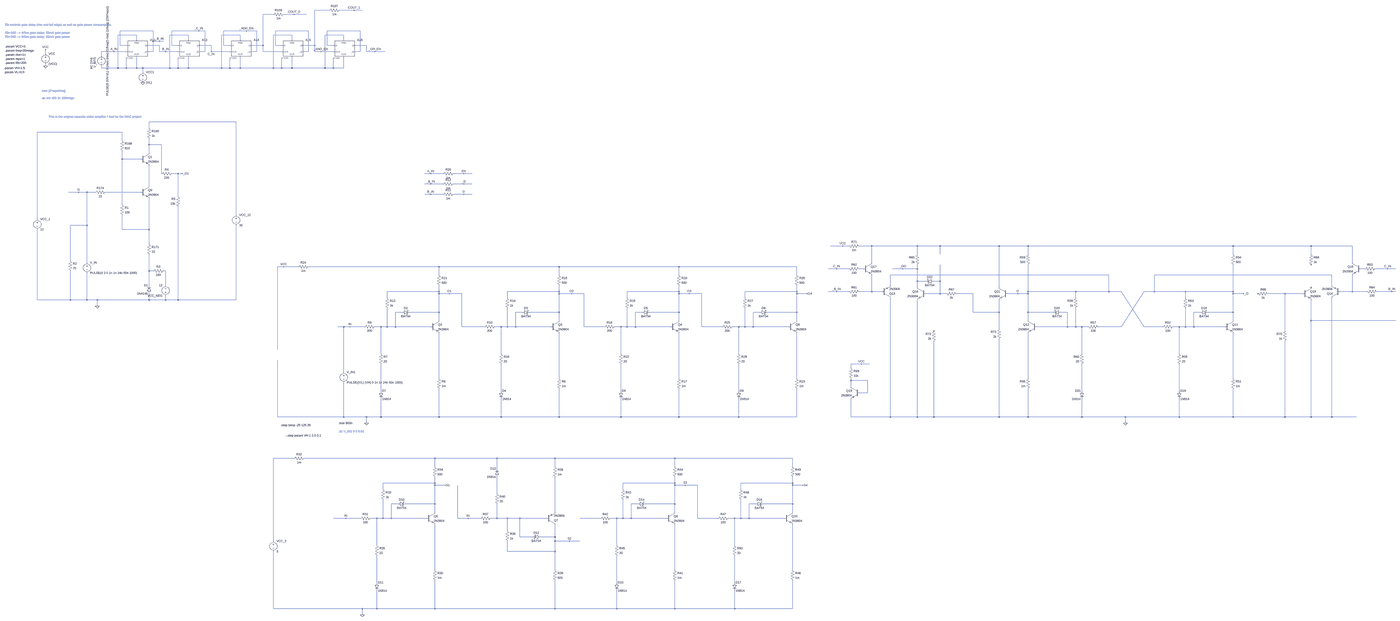
[diagram p0: schematic register_bjt.asc, whole sheet]
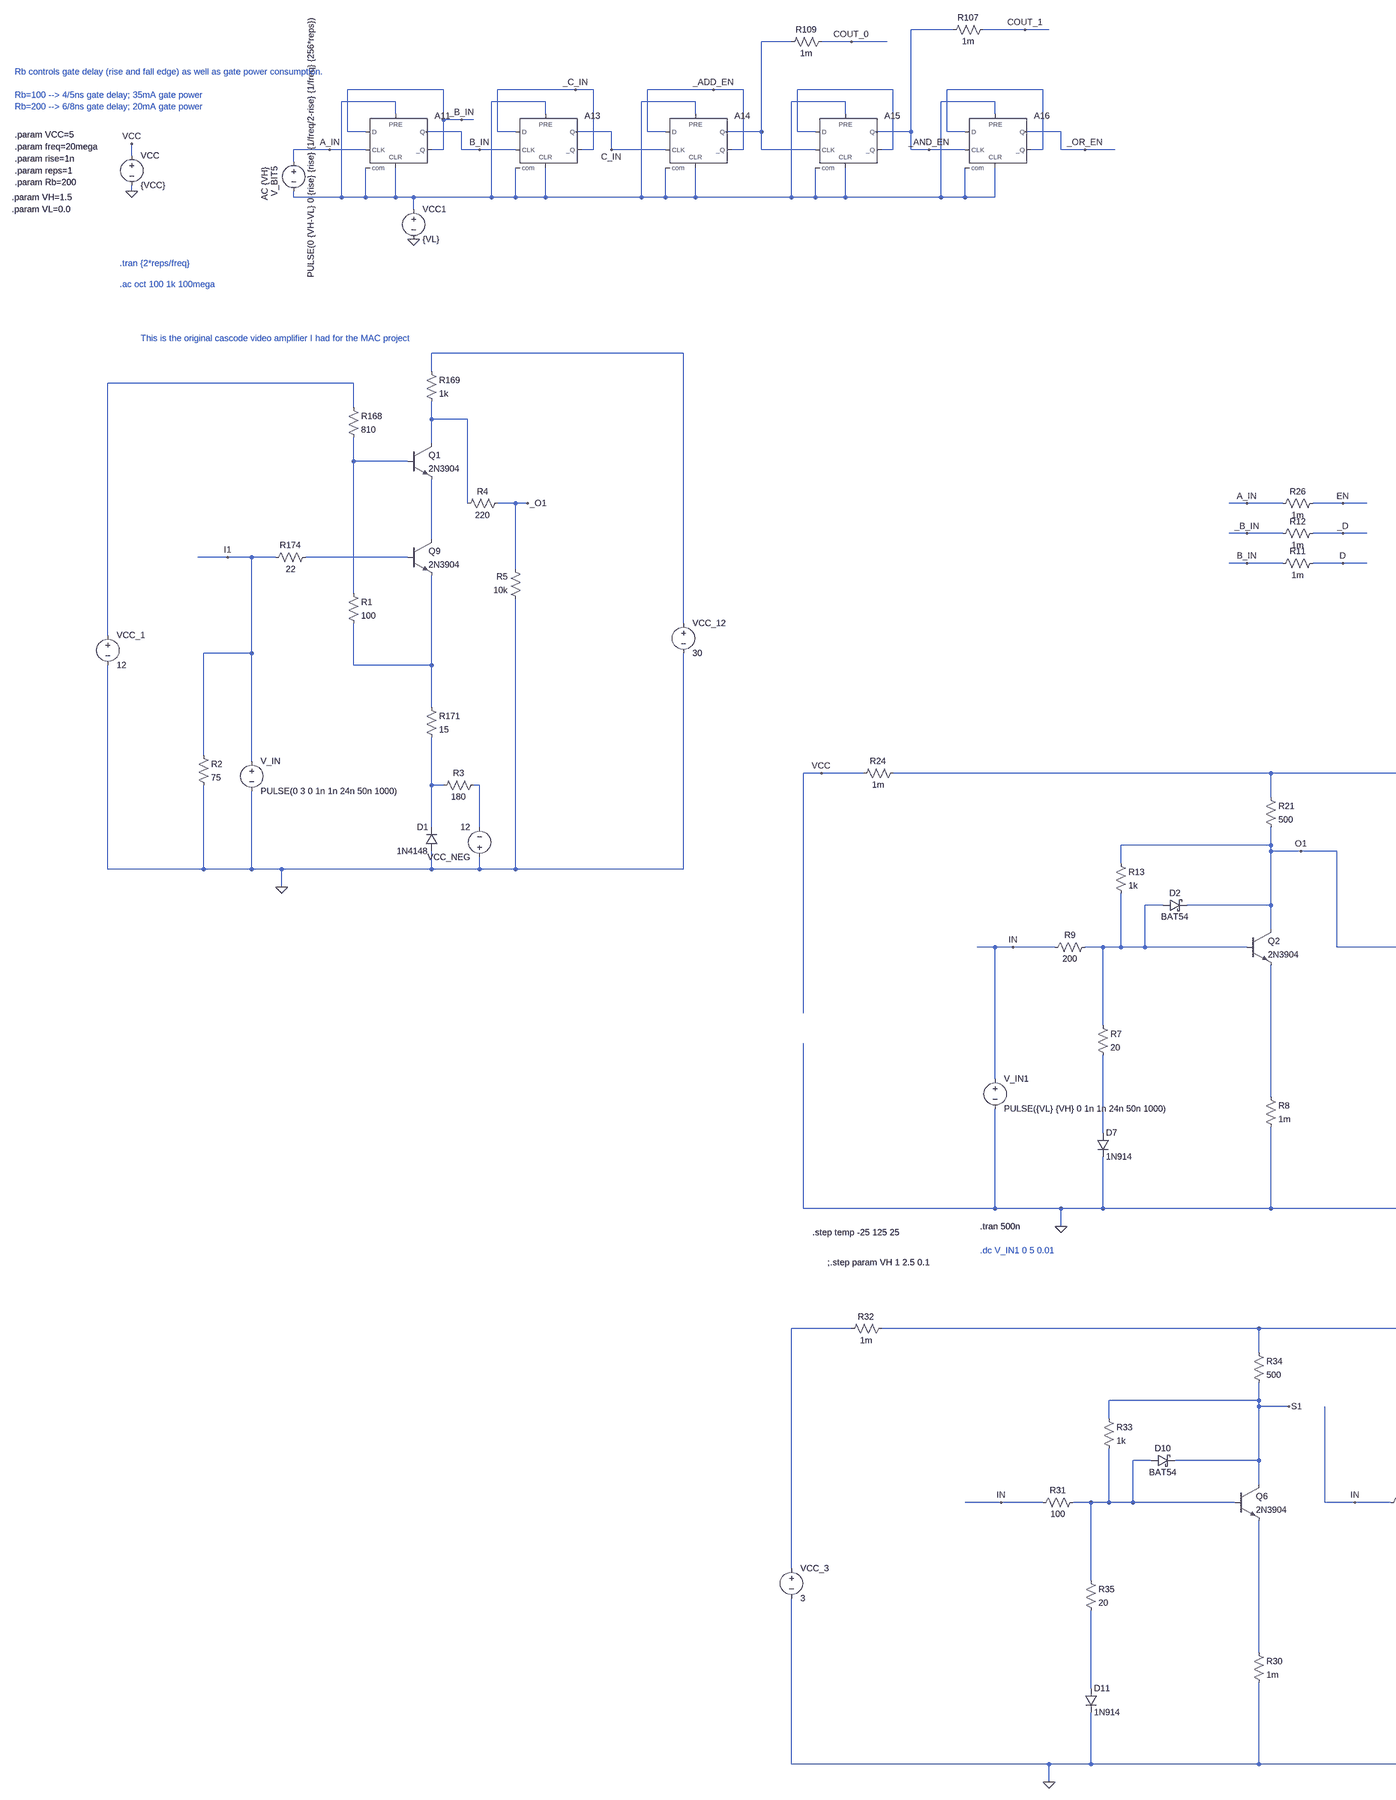
[diagram p1: schematic register_bjt.asc, part, row 1 of 1, column 1 of 3]
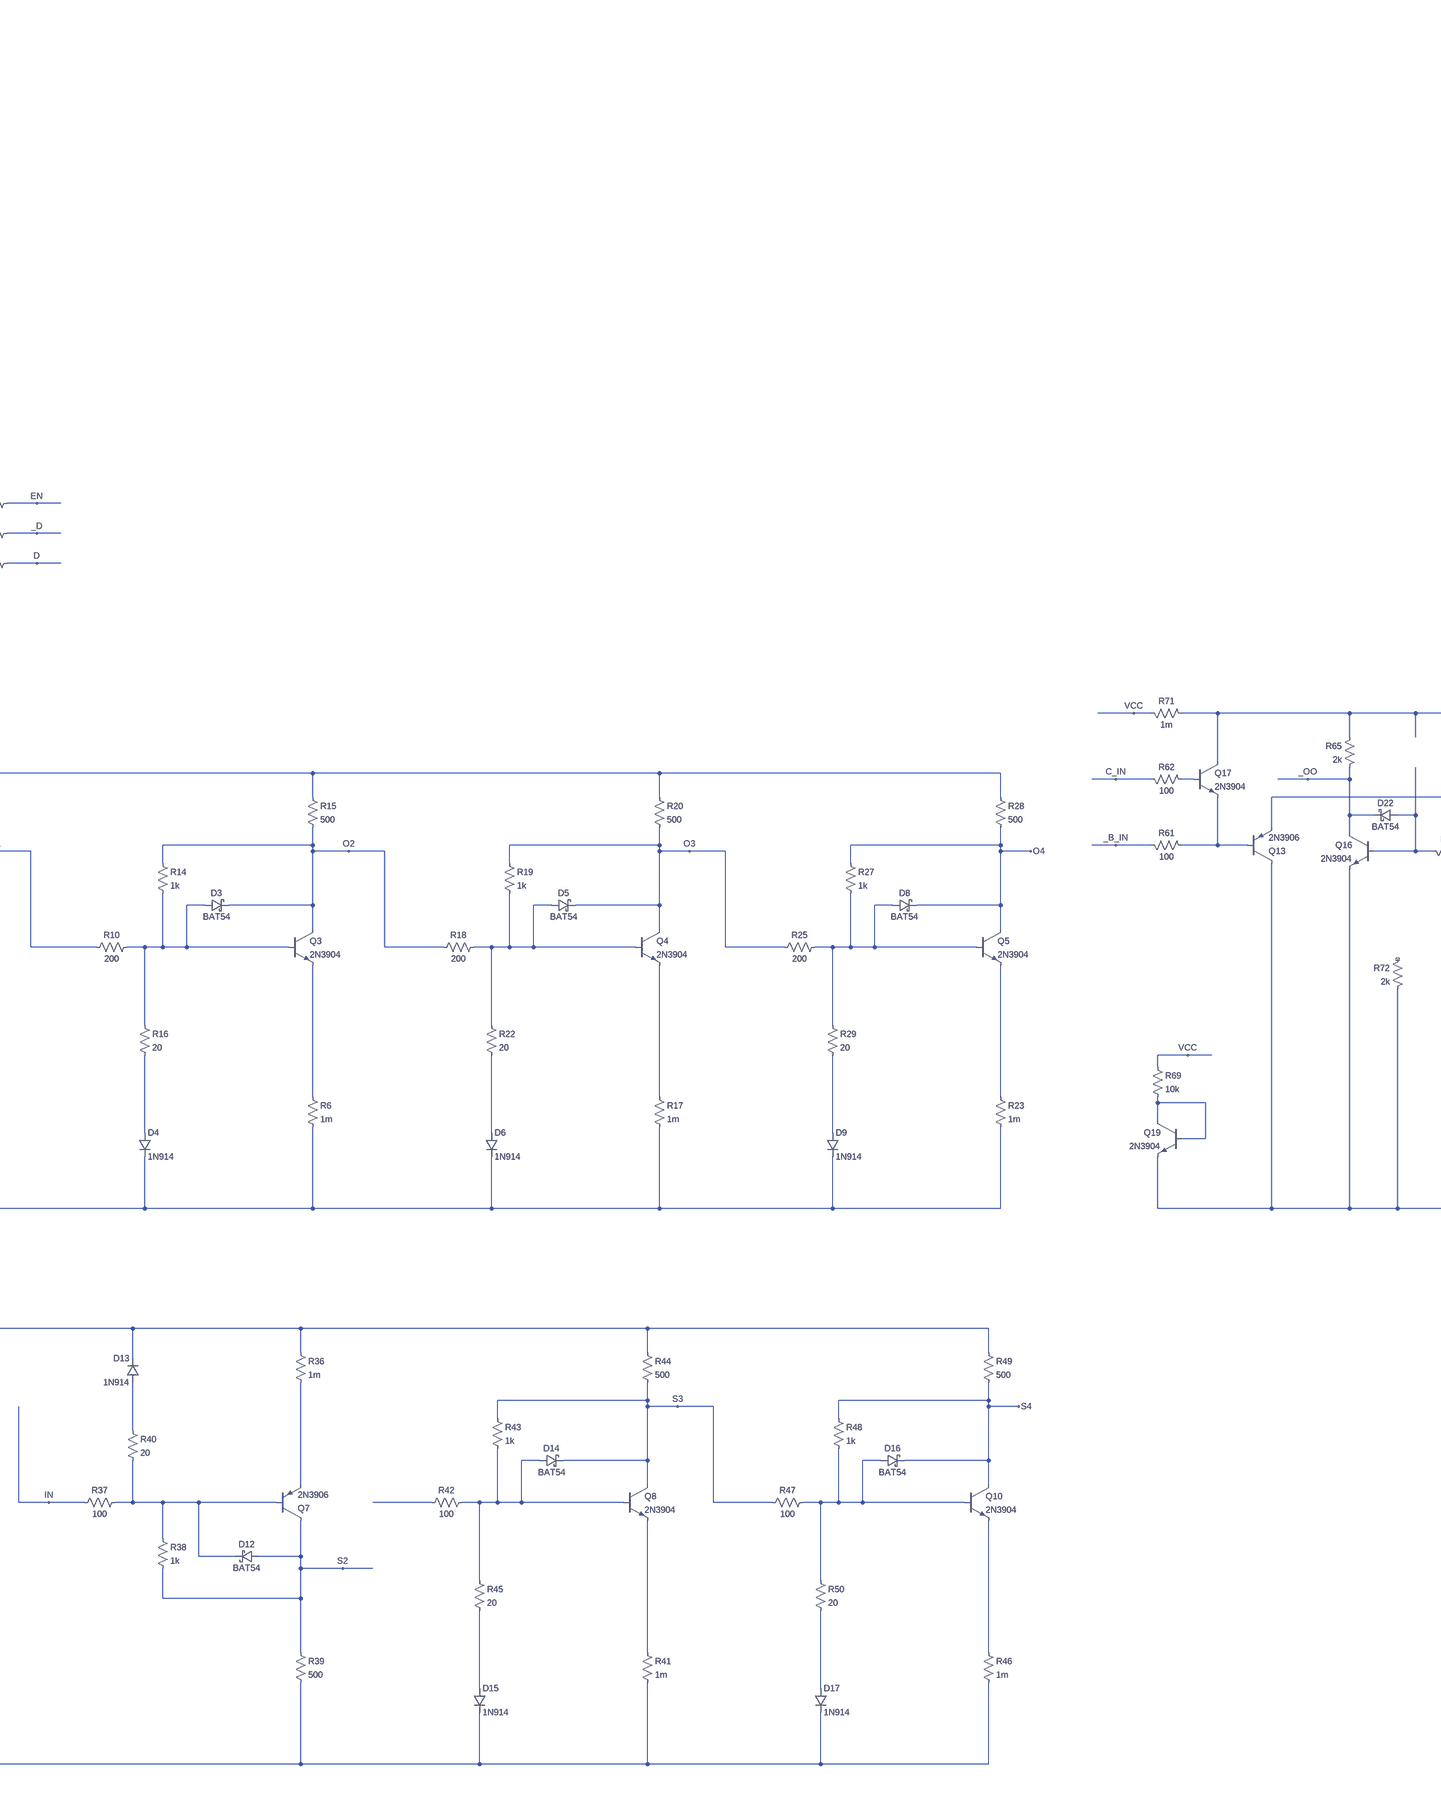
[diagram p2: schematic register_bjt.asc, part, row 1 of 1, column 2 of 3]
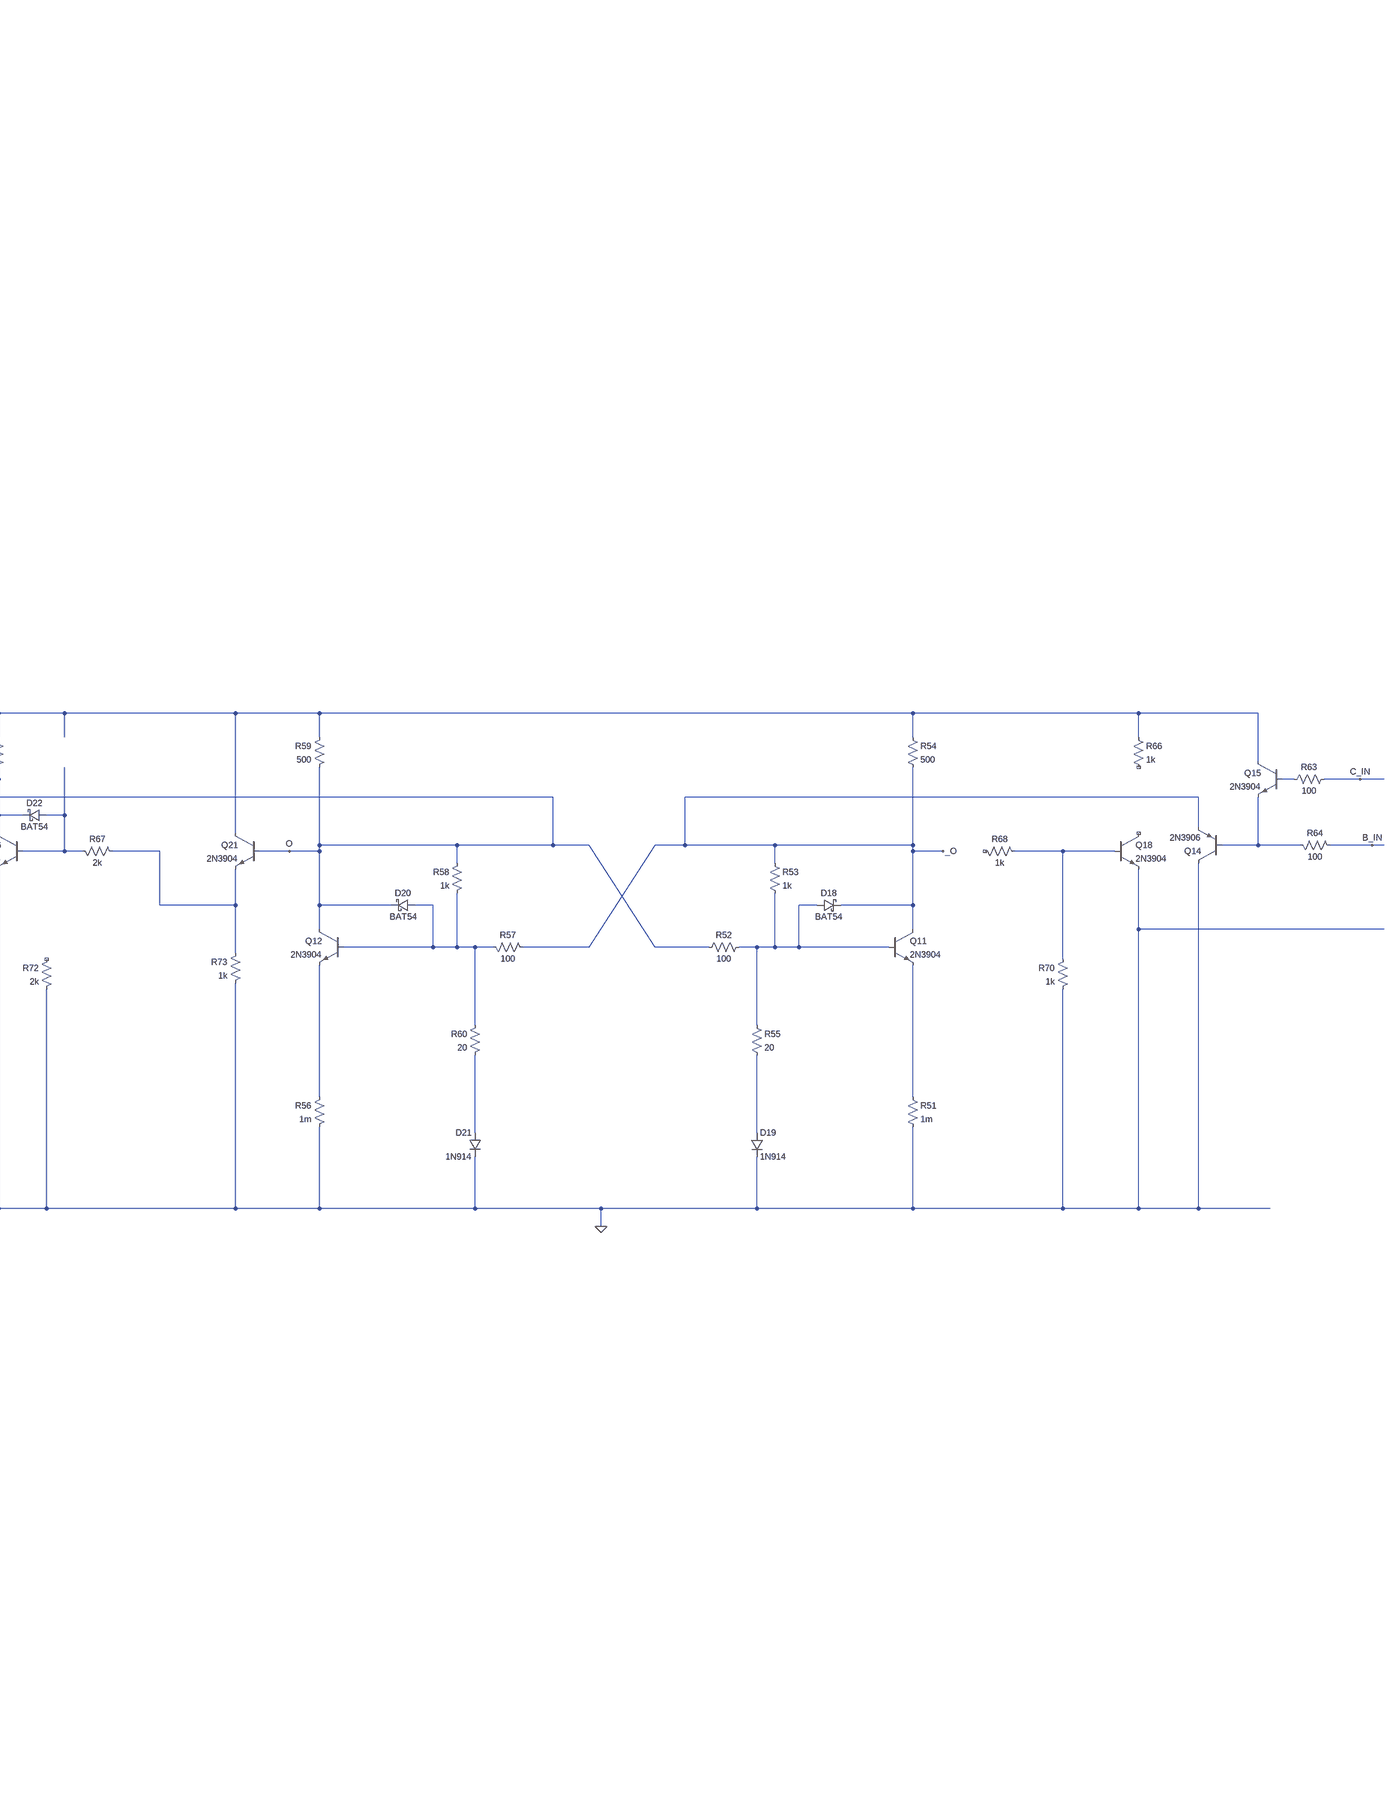
[diagram p3: schematic register_bjt.asc, part, row 1 of 1, column 3 of 3]
register_bjt.asc, the LTspice schematic file:
Version 4
SHEET 1 20052 9880
WIRE 1392 1344 1280 1344
WIRE 1584 1344 1472 1344
WIRE 1648 1344 1584 1344
WIRE 960 1376 880 1376
WIRE 1120 1376 1040 1376
WIRE 1216 1376 1120 1376
WIRE 32 1504 -224 1504
WIRE 384 1504 176 1504
WIRE 432 1504 384 1504
WIRE 752 1504 576 1504
WIRE 832 1504 752 1504
WIRE 1232 1504 976 1504
WIRE 1632 1504 1376 1504
WIRE -96 1536 -240 1536
WIRE 304 1536 160 1536
WIRE 704 1536 560 1536
WIRE 1104 1536 960 1536
WIRE 1504 1536 1360 1536
WIRE -96 1568 -96 1536
WIRE 304 1568 304 1536
WIRE 704 1568 704 1536
WIRE 1104 1568 1104 1536
WIRE 1504 1568 1504 1536
WIRE 32 1584 32 1504
WIRE 80 1584 32 1584
WIRE 112 1584 80 1584
WIRE -224 1616 -224 1504
WIRE -176 1616 -224 1616
WIRE 80 1616 -16 1616
WIRE 176 1616 176 1504
WIRE 224 1616 176 1616
WIRE 480 1616 384 1616
WIRE 576 1616 576 1504
WIRE 624 1616 576 1616
WIRE 880 1616 880 1376
WIRE 880 1616 784 1616
WIRE 976 1616 976 1504
WIRE 1024 1616 976 1616
WIRE 1280 1616 1280 1344
WIRE 1280 1616 1184 1616
WIRE 1376 1616 1376 1504
WIRE 1424 1616 1376 1616
WIRE 1680 1616 1584 1616
WIRE -272 1664 -368 1664
WIRE -176 1664 -272 1664
WIRE 32 1664 32 1584
WIRE 32 1664 0 1664
WIRE 80 1664 80 1616
WIRE 128 1664 80 1664
WIRE 224 1664 128 1664
WIRE 432 1664 432 1504
WIRE 432 1664 400 1664
WIRE 480 1664 480 1616
WIRE 624 1664 480 1664
WIRE 832 1664 832 1504
WIRE 832 1664 800 1664
WIRE 880 1664 880 1616
WIRE 1024 1664 880 1664
WIRE 1232 1664 1232 1504
WIRE 1232 1664 1200 1664
WIRE 1280 1664 1280 1616
WIRE 1328 1664 1280 1664
WIRE 1424 1664 1328 1664
WIRE 1632 1664 1632 1504
WIRE 1632 1664 1600 1664
WIRE 1680 1664 1680 1616
WIRE 1744 1664 1680 1664
WIRE 1824 1664 1744 1664
WIRE -800 1680 -800 1648
WIRE -368 1696 -368 1664
WIRE -800 1776 -800 1760
WIRE -368 1792 -368 1776
WIRE -240 1792 -240 1536
WIRE -240 1792 -368 1792
WIRE -176 1792 -176 1712
WIRE -176 1792 -240 1792
WIRE -96 1792 -96 1712
WIRE -96 1792 -176 1792
WIRE -48 1792 -96 1792
WIRE 160 1792 160 1536
WIRE 160 1792 -48 1792
WIRE 224 1792 224 1712
WIRE 224 1792 160 1792
WIRE 304 1792 304 1712
WIRE 304 1792 224 1792
WIRE 560 1792 560 1536
WIRE 560 1792 304 1792
WIRE 624 1792 624 1712
WIRE 624 1792 560 1792
WIRE 704 1792 704 1712
WIRE 704 1792 624 1792
WIRE 960 1792 960 1536
WIRE 960 1792 704 1792
WIRE 1024 1792 1024 1712
WIRE 1024 1792 960 1792
WIRE 1104 1792 1104 1712
WIRE 1104 1792 1024 1792
WIRE 1360 1792 1360 1536
WIRE 1360 1792 1104 1792
WIRE 1424 1792 1424 1712
WIRE 1424 1792 1360 1792
WIRE 1504 1792 1504 1712
WIRE 1504 1792 1424 1792
WIRE -48 1824 -48 1792
WIRE 672 2208 0 2208
WIRE 0 2256 0 2208
WIRE -208 2288 -864 2288
WIRE -208 2352 -208 2288
WIRE 0 2384 0 2336
WIRE 96 2384 0 2384
WIRE 0 2448 0 2384
WIRE -208 2496 -208 2432
WIRE -64 2496 -208 2496
WIRE 96 2608 96 2384
WIRE 224 2608 176 2608
WIRE 256 2608 224 2608
WIRE 2176 2608 2128 2608
WIRE 2272 2608 2176 2608
WIRE 2432 2608 2352 2608
WIRE 2496 2608 2432 2608
WIRE 2176 2688 2128 2688
WIRE 2272 2688 2176 2688
WIRE 2432 2688 2352 2688
WIRE 2496 2688 2432 2688
WIRE 0 2704 0 2544
WIRE -544 2752 -624 2752
WIRE -480 2752 -544 2752
WIRE -416 2752 -480 2752
WIRE -64 2752 -336 2752
WIRE 2176 2768 2128 2768
WIRE 2272 2768 2176 2768
WIRE 2432 2768 2352 2768
WIRE 2496 2768 2432 2768
WIRE 224 2784 224 2608
WIRE -208 2848 -208 2496
WIRE 672 2928 672 2208
WIRE -864 2960 -864 2288
WIRE -480 3008 -480 2752
WIRE -480 3008 -608 3008
WIRE -208 3040 -208 2928
WIRE 0 3040 0 2800
WIRE 0 3040 -208 3040
WIRE 0 3152 0 3040
WIRE 6192 3168 6096 3168
WIRE 6240 3168 6192 3168
WIRE 6416 3168 6320 3168
WIRE 6768 3168 6416 3168
WIRE 6944 3168 6768 3168
WIRE 7984 3168 6944 3168
WIRE 8208 3168 7984 3168
WIRE 9856 3168 8208 3168
WIRE 10480 3168 9856 3168
WIRE 10800 3168 10480 3168
WIRE 6768 3232 6768 3168
WIRE 6944 3232 6944 3168
WIRE 8208 3232 8208 3168
WIRE 9856 3232 9856 3168
WIRE 10480 3232 10480 3168
WIRE -608 3280 -608 3008
WIRE -480 3296 -480 3008
WIRE 6416 3296 6416 3168
WIRE 10800 3296 10800 3168
WIRE 1040 3328 992 3328
WIRE 1152 3328 1040 3328
WIRE 2240 3328 1232 3328
WIRE 3168 3328 2240 3328
WIRE 4112 3328 3168 3328
WIRE 5040 3328 4112 3328
WIRE 6144 3344 6080 3344
WIRE 6240 3344 6144 3344
WIRE 6352 3344 6320 3344
WIRE 6656 3344 6576 3344
WIRE 6768 3344 6768 3312
WIRE 6768 3344 6656 3344
WIRE 10896 3344 10864 3344
WIRE 11072 3344 10976 3344
WIRE 11136 3344 11072 3344
WIRE 0 3360 0 3232
WIRE 32 3360 0 3360
WIRE 128 3360 112 3360
WIRE 2240 3392 2240 3328
WIRE 3168 3392 3168 3328
WIRE 4112 3392 4112 3328
WIRE 5040 3392 5040 3328
WIRE 8864 3392 6560 3392
WIRE 10640 3392 9216 3392
WIRE 6768 3440 6768 3344
WIRE 6832 3440 6768 3440
WIRE 6944 3440 6944 3312
WIRE 6944 3440 6896 3440
WIRE 0 3472 0 3360
WIRE 128 3472 128 3360
WIRE 6560 3472 6560 3392
WIRE 10640 3472 10640 3392
WIRE 6768 3488 6768 3440
WIRE 7984 3488 7984 3168
WIRE 2240 3520 2240 3472
WIRE 2240 3520 1840 3520
WIRE 3168 3520 3168 3472
WIRE 3168 3520 2768 3520
WIRE 4112 3520 4112 3472
WIRE 4112 3520 3712 3520
WIRE 5040 3520 5040 3472
WIRE 5040 3520 4640 3520
WIRE 6144 3520 6080 3520
WIRE 6240 3520 6144 3520
WIRE 6416 3520 6416 3392
WIRE 6416 3520 6320 3520
WIRE 6496 3520 6416 3520
WIRE 8208 3520 8208 3312
WIRE 8608 3520 8208 3520
WIRE 8864 3520 8864 3392
WIRE 8864 3520 8608 3520
WIRE 8960 3520 8864 3520
WIRE 9216 3520 9216 3392
WIRE 9216 3520 9136 3520
WIRE 9456 3520 9216 3520
WIRE 9856 3520 9856 3312
WIRE 9856 3520 9456 3520
WIRE 10800 3520 10800 3392
WIRE 10800 3520 10704 3520
WIRE 10912 3520 10800 3520
WIRE 11104 3520 10992 3520
WIRE 11136 3520 11104 3520
WIRE 2240 3536 2240 3520
WIRE 2320 3536 2240 3536
WIRE 2416 3536 2320 3536
WIRE 3168 3536 3168 3520
WIRE 3264 3536 3168 3536
WIRE 3360 3536 3264 3536
WIRE 4112 3536 4112 3520
WIRE 4192 3536 4112 3536
WIRE 4288 3536 4192 3536
WIRE 5040 3536 5040 3520
WIRE 5120 3536 5040 3536
WIRE 6944 3536 6944 3440
WIRE 6944 3536 6832 3536
WIRE 6992 3536 6944 3536
WIRE 7456 3536 7072 3536
WIRE 8128 3536 8048 3536
WIRE 8208 3536 8208 3520
WIRE 8208 3536 8128 3536
WIRE 9856 3536 9856 3520
WIRE 9936 3536 9856 3536
WIRE 10256 3536 10128 3536
WIRE 10416 3536 10256 3536
WIRE 1840 3568 1840 3520
WIRE 2768 3568 2768 3520
WIRE 3712 3568 3712 3520
WIRE 4640 3568 4640 3520
WIRE 8608 3568 8608 3520
WIRE 9456 3568 9456 3520
WIRE -864 3584 -864 3040
WIRE -608 3584 -608 3360
WIRE -608 3584 -864 3584
WIRE -480 3584 -480 3376
WIRE -480 3584 -608 3584
WIRE -400 3584 -480 3584
WIRE 0 3584 0 3536
WIRE 0 3584 -400 3584
WIRE 128 3584 128 3552
WIRE 128 3584 0 3584
WIRE 224 3584 224 2864
WIRE 224 3584 128 3584
WIRE 672 3584 672 3008
WIRE 672 3584 224 3584
WIRE -400 3632 -400 3584
WIRE 1952 3680 1904 3680
WIRE 2240 3680 2240 3536
WIRE 2240 3680 2016 3680
WIRE 2880 3680 2832 3680
WIRE 3168 3680 3168 3536
WIRE 3168 3680 2944 3680
WIRE 3824 3680 3776 3680
WIRE 4112 3680 4112 3536
WIRE 4112 3680 3888 3680
WIRE 4752 3680 4704 3680
WIRE 5040 3680 5040 3536
WIRE 5040 3680 4816 3680
WIRE 7456 3680 7456 3536
WIRE 7984 3680 7984 3584
WIRE 7984 3680 7456 3680
WIRE 8208 3680 8208 3536
WIRE 8432 3680 8208 3680
WIRE 8544 3680 8496 3680
WIRE 9568 3680 9520 3680
WIRE 9856 3680 9856 3536
WIRE 9856 3680 9632 3680
WIRE 2240 3744 2240 3680
WIRE 3168 3744 3168 3680
WIRE 4112 3744 4112 3680
WIRE 5040 3744 5040 3680
WIRE 8208 3744 8208 3680
WIRE 9856 3744 9856 3680
WIRE 10480 3744 10480 3584
WIRE 11136 3744 10480 3744
WIRE 1504 3792 1456 3792
WIRE 1552 3792 1504 3792
WIRE 1664 3792 1552 3792
WIRE 1792 3792 1744 3792
WIRE 1840 3792 1840 3648
WIRE 1840 3792 1792 3792
WIRE 1904 3792 1904 3680
WIRE 1904 3792 1840 3792
WIRE 2176 3792 1904 3792
WIRE 2416 3792 2416 3536
WIRE 2592 3792 2416 3792
WIRE 2720 3792 2672 3792
WIRE 2768 3792 2768 3648
WIRE 2768 3792 2720 3792
WIRE 2832 3792 2832 3680
WIRE 2832 3792 2768 3792
WIRE 3104 3792 2832 3792
WIRE 3360 3792 3360 3536
WIRE 3536 3792 3360 3792
WIRE 3664 3792 3616 3792
WIRE 3712 3792 3712 3648
WIRE 3712 3792 3664 3792
WIRE 3776 3792 3776 3680
WIRE 3776 3792 3712 3792
WIRE 4048 3792 3776 3792
WIRE 4288 3792 4288 3536
WIRE 4464 3792 4288 3792
WIRE 4592 3792 4544 3792
WIRE 4640 3792 4640 3648
WIRE 4640 3792 4592 3792
WIRE 4704 3792 4704 3680
WIRE 4704 3792 4640 3792
WIRE 4976 3792 4704 3792
WIRE 8544 3792 8544 3680
WIRE 8544 3792 8272 3792
WIRE 8608 3792 8608 3648
WIRE 8608 3792 8544 3792
WIRE 8656 3792 8608 3792
WIRE 8704 3792 8656 3792
WIRE 8960 3792 9136 3520
WIRE 8960 3792 8784 3792
WIRE 9136 3792 8960 3520
WIRE 9280 3792 9136 3792
WIRE 9408 3792 9360 3792
WIRE 9456 3792 9456 3648
WIRE 9456 3792 9408 3792
WIRE 9520 3792 9520 3680
WIRE 9520 3792 9456 3792
WIRE 9792 3792 9520 3792
WIRE 7984 3808 7984 3680
WIRE 10256 3824 10256 3536
WIRE 992 3968 992 3328
WIRE 1792 4000 1792 3792
WIRE 2720 4000 2720 3792
WIRE 3664 4000 3664 3792
WIRE 4592 4000 4592 3792
WIRE 8656 4000 8656 3792
WIRE 9408 4000 9408 3792
WIRE 6336 4080 6256 4080
WIRE 6400 4080 6336 4080
WIRE 6256 4112 6256 4080
WIRE 1504 4144 1504 3792
WIRE 2240 4192 2240 3840
WIRE 3168 4192 3168 3840
WIRE 4112 4192 4112 3840
WIRE 5040 4192 5040 3840
WIRE 8208 4192 8208 3840
WIRE 9856 4192 9856 3840
WIRE 6256 4208 6256 4192
WIRE 6384 4208 6256 4208
WIRE 6256 4256 6256 4208
WIRE 1792 4288 1792 4080
WIRE 2720 4288 2720 4080
WIRE 3664 4288 3664 4080
WIRE 4592 4288 4592 4080
WIRE 8656 4288 8656 4080
WIRE 9408 4288 9408 4080
WIRE 6384 4304 6384 4208
WIRE 6384 4304 6320 4304
WIRE 992 4624 992 4048
WIRE 1504 4624 1504 4224
WIRE 1504 4624 992 4624
WIRE 1680 4624 1504 4624
WIRE 1792 4624 1792 4352
WIRE 1792 4624 1680 4624
WIRE 2240 4624 2240 4272
WIRE 2240 4624 1792 4624
WIRE 2720 4624 2720 4352
WIRE 2720 4624 2240 4624
WIRE 3168 4624 3168 4272
WIRE 3168 4624 2720 4624
WIRE 3664 4624 3664 4352
WIRE 3664 4624 3168 4624
WIRE 4112 4624 4112 4272
WIRE 4112 4624 3664 4624
WIRE 4592 4624 4592 4352
WIRE 4592 4624 4112 4624
WIRE 5040 4624 5040 4272
WIRE 5040 4624 4592 4624
WIRE 6256 4624 6256 4352
WIRE 6560 4624 6560 3568
WIRE 6560 4624 6256 4624
WIRE 6768 4624 6768 3584
WIRE 6768 4624 6560 4624
WIRE 6896 4624 6896 3904
WIRE 6896 4624 6768 4624
WIRE 7984 4624 7984 3888
WIRE 7984 4624 6896 4624
WIRE 8208 4624 8208 4272
WIRE 8208 4624 7984 4624
WIRE 8656 4624 8656 4352
WIRE 8656 4624 8208 4624
WIRE 8992 4624 8656 4624
WIRE 9408 4624 9408 4352
WIRE 9408 4624 8992 4624
WIRE 9856 4624 9856 4272
WIRE 9856 4624 9408 4624
WIRE 10256 4624 10256 3904
WIRE 10256 4624 9856 4624
WIRE 10480 4624 10480 3744
WIRE 10480 4624 10256 4624
WIRE 10640 4624 10640 3568
WIRE 10640 4624 10480 4624
WIRE 10832 4624 10640 4624
WIRE 1680 4672 1680 4624
WIRE 8992 4672 8992 4624
WIRE 1120 5072 960 5072
WIRE 2208 5072 1200 5072
WIRE 2688 5072 2208 5072
WIRE 3136 5072 2688 5072
WIRE 4080 5072 3136 5072
WIRE 5008 5072 4080 5072
WIRE 2208 5136 2208 5072
WIRE 3136 5136 3136 5072
WIRE 4080 5136 4080 5072
WIRE 5008 5136 5008 5072
WIRE 2688 5152 2688 5072
WIRE 2208 5264 2208 5216
WIRE 2208 5264 1808 5264
WIRE 4080 5264 4080 5216
WIRE 4080 5264 3680 5264
WIRE 5008 5264 5008 5216
WIRE 5008 5264 4608 5264
WIRE 2208 5280 2208 5264
WIRE 2288 5280 2208 5280
WIRE 4080 5280 4080 5264
WIRE 4160 5280 4080 5280
WIRE 4256 5280 4160 5280
WIRE 5008 5280 5008 5264
WIRE 5088 5280 5008 5280
WIRE 1808 5312 1808 5264
WIRE 3680 5312 3680 5264
WIRE 4608 5312 4608 5264
WIRE 2688 5344 2688 5216
WIRE 1920 5424 1872 5424
WIRE 2208 5424 2208 5280
WIRE 2208 5424 1984 5424
WIRE 3792 5424 3744 5424
WIRE 4080 5424 4080 5280
WIRE 4080 5424 3856 5424
WIRE 4720 5424 4672 5424
WIRE 5008 5424 5008 5280
WIRE 5008 5424 4784 5424
WIRE 2208 5488 2208 5424
WIRE 3136 5488 3136 5216
WIRE 4080 5488 4080 5424
WIRE 5008 5488 5008 5424
WIRE 1520 5536 1424 5536
WIRE 1632 5536 1520 5536
WIRE 1760 5536 1712 5536
WIRE 1808 5536 1808 5392
WIRE 1808 5536 1760 5536
WIRE 1872 5536 1872 5424
WIRE 1872 5536 1808 5536
WIRE 2144 5536 1872 5536
WIRE 2384 5536 2384 5280
WIRE 2464 5536 2384 5536
WIRE 2560 5536 2464 5536
WIRE 2688 5536 2688 5424
WIRE 2688 5536 2640 5536
WIRE 2768 5536 2688 5536
WIRE 2864 5536 2768 5536
WIRE 3072 5536 2864 5536
WIRE 3504 5536 3328 5536
WIRE 3632 5536 3584 5536
WIRE 3680 5536 3680 5392
WIRE 3680 5536 3632 5536
WIRE 3744 5536 3744 5424
WIRE 3744 5536 3680 5536
WIRE 4016 5536 3744 5536
WIRE 4256 5536 4256 5280
WIRE 4432 5536 4256 5536
WIRE 4560 5536 4512 5536
WIRE 4608 5536 4608 5392
WIRE 4608 5536 4560 5536
WIRE 4672 5536 4672 5424
WIRE 4672 5536 4608 5536
WIRE 4944 5536 4672 5536
WIRE 2768 5632 2768 5536
WIRE 2864 5680 2864 5536
WIRE 2960 5680 2864 5680
WIRE 3136 5680 3136 5584
WIRE 3136 5680 3024 5680
WIRE 960 5712 960 5072
WIRE 3136 5712 3136 5680
WIRE 3248 5712 3136 5712
WIRE 3328 5712 3248 5712
WIRE 1760 5744 1760 5536
WIRE 3632 5744 3632 5536
WIRE 4560 5744 4560 5536
WIRE 2768 5792 2768 5712
WIRE 3136 5792 3136 5712
WIRE 3136 5792 2768 5792
WIRE 2208 5936 2208 5584
WIRE 3136 5936 3136 5792
WIRE 4080 5936 4080 5584
WIRE 5008 5936 5008 5584
WIRE 1760 6032 1760 5824
WIRE 3632 6032 3632 5824
WIRE 4560 6032 4560 5824
WIRE 960 6368 960 5792
WIRE 1648 6368 960 6368
WIRE 1760 6368 1760 6096
WIRE 1760 6368 1648 6368
WIRE 2208 6368 2208 6016
WIRE 2208 6368 1760 6368
WIRE 3136 6368 3136 6016
WIRE 3136 6368 2208 6368
WIRE 3632 6368 3632 6096
WIRE 3632 6368 3136 6368
WIRE 4080 6368 4080 6016
WIRE 4080 6368 3632 6368
WIRE 4560 6368 4560 6096
WIRE 4560 6368 4080 6368
WIRE 5008 6368 5008 6016
WIRE 5008 6368 4560 6368
WIRE 1648 6416 1648 6368
FLAG -800 1776 0
FLAG -800 1648 VCC
FLAG -400 3632 0
FLAG -272 1664 A_IN
FLAG 128 1664 B_IN
FLAG 480 1664 C_IN
FLAG 752 1504 _ADD_EN
FLAG 1328 1664 _AND_EN
FLAG 1744 1664 _OR_EN
FLAG 1120 1376 COUT_0
FLAG 1584 1344 COUT_1
FLAG 80 1584 _B_IN
FLAG 2432 2608 EN
FLAG 2432 2688 _D
FLAG 2432 2768 D
FLAG 2176 2608 A_IN
FLAG 2176 2688 _B_IN
FLAG 2176 2768 B_IN
FLAG 256 2608 _O1
FLAG -544 2752 I1
FLAG 1680 4672 0
FLAG 2320 3536 O1
FLAG 1552 3792 IN
FLAG 3264 3536 O2
FLAG 5120 3536 O4
FLAG 4192 3536 O3
FLAG 1648 6416 0
FLAG 2288 5280 S1
FLAG 1520 5536 IN
FLAG 3248 5712 S2
FLAG 5088 5280 S4
FLAG 4160 5280 S3
FLAG 2464 5536 IN
FLAG 8128 3536 O
FLAG 384 1504 _C_IN
FLAG 6144 3520 _B_IN
FLAG 11104 3520 B_IN
FLAG 6144 3344 C_IN
FLAG 8992 4672 0
FLAG 1040 3328 VCC
FLAG 6192 3168 VCC
FLAG 11072 3344 C_IN
FLAG 9936 3536 _O
FLAG -48 1904 0
FLAG 6656 3344 _OO
FLAG 6336 4080 VCC
SYMBOL voltage -800 1664 R0
WINDOW 123 0 0 Left 0
WINDOW 39 0 0 Left 0
SYMATTR InstName VCC
SYMATTR Value {VCC}
SYMBOL npn -64 2704 R0
SYMATTR InstName Q9
SYMATTR Value 2N3904
SYMBOL res -224 2336 R0
SYMATTR InstName R168
SYMATTR Value 810
SYMBOL res -16 2240 R0
SYMATTR InstName R169
SYMATTR Value 1k
SYMBOL res -16 3136 R0
SYMATTR InstName R171
SYMATTR Value 15
SYMBOL res -432 2768 R270
WINDOW 0 32 56 VTop 2
WINDOW 3 0 56 VBottom 2
SYMATTR InstName R174
SYMATTR Value 22
SYMBOL voltage -368 1680 R0
WINDOW 123 -77 30 VRight 2
WINDOW 39 0 0 Left 0
WINDOW 0 -51 28 VRight 2
WINDOW 3 46 -379 VRight 2
SYMATTR Value2 AC {VH}
SYMATTR InstName V_BIT5
SYMATTR Value PULSE(0 {VH-VL} 0 {rise} {rise} {1/freq/2-rise} {1/freq} {256*reps})
SYMBOL Digital\\dflop -96 1568 R0
SYMATTR SpiceLine Vhigh={VH-VL}
SYMATTR InstName A11
SYMBOL Digital\\dflop 304 1568 R0
SYMATTR SpiceLine Vhigh={VH-VL}
SYMATTR InstName A13
SYMBOL Digital\\dflop 1104 1568 R0
SYMATTR SpiceLine Vhigh={VH-VL}
SYMATTR InstName A15
SYMBOL Digital\\dflop 1504 1568 R0
SYMATTR SpiceLine Vhigh={VH-VL}
SYMATTR InstName A16
SYMBOL Digital\\dflop 704 1568 R0
SYMATTR SpiceLine Vhigh={VH-VL}
SYMATTR InstName A14
SYMBOL res 1488 1328 R90
WINDOW 0 0 56 VBottom 2
WINDOW 3 32 56 VTop 2
SYMATTR InstName R107
SYMATTR Value 1m
SYMBOL res 1056 1360 R90
WINDOW 0 0 56 VBottom 2
WINDOW 3 32 56 VTop 2
SYMATTR InstName R109
SYMATTR Value 1m
SYMBOL res 2256 2784 R270
WINDOW 0 32 56 VTop 2
WINDOW 3 0 56 VBottom 2
SYMATTR InstName R11
SYMATTR Value 1m
SYMBOL res 2256 2704 R270
WINDOW 0 32 56 VTop 2
WINDOW 3 0 56 VBottom 2
SYMATTR InstName R12
SYMATTR Value 1m
SYMBOL res 2256 2624 R270
WINDOW 0 32 56 VTop 2
WINDOW 3 0 56 VBottom 2
SYMATTR InstName R26
SYMATTR Value 1m
SYMBOL npn -64 2448 R0
SYMATTR InstName Q1
SYMATTR Value 2N3904
SYMBOL res -224 2832 R0
SYMATTR InstName R1
SYMATTR Value 100
SYMBOL diode 16 3536 R180
WINDOW 0 24 64 Left 2
WINDOW 3 24 0 Left 2
SYMATTR InstName D1
SYMATTR Value 1N4148
SYMBOL voltage 128 3568 R180
WINDOW 123 0 0 Left 0
WINDOW 39 0 0 Left 0
SYMATTR InstName VCC_NEG
SYMATTR Value 12
SYMBOL res 128 3344 R90
WINDOW 0 0 56 VBottom 2
WINDOW 3 32 56 VTop 2
SYMATTR InstName R3
SYMATTR Value 180
SYMBOL voltage 672 2912 R0
WINDOW 123 0 0 Left 0
WINDOW 39 0 0 Left 0
SYMATTR InstName VCC_12
SYMATTR Value 30
SYMBOL voltage -480 3280 R0
WINDOW 123 0 0 Left 0
WINDOW 39 0 0 Left 0
SYMATTR InstName V_IN
SYMATTR Value PULSE(0 3 0 1n 1n 24n 50n 1000)
SYMBOL voltage -864 2944 R0
WINDOW 123 0 0 Left 0
WINDOW 39 0 0 Left 0
SYMATTR InstName VCC_1
SYMATTR Value 12
SYMBOL res -624 3264 R0
SYMATTR InstName R2
SYMATTR Value 75
SYMBOL res 192 2592 R90
WINDOW 0 0 56 VBottom 2
WINDOW 3 32 56 VTop 2
SYMATTR InstName R4
SYMATTR Value 220
SYMBOL res 240 2880 R180
WINDOW 0 36 76 Left 2
WINDOW 3 36 40 Left 2
SYMATTR InstName R5
SYMATTR Value 10k
SYMBOL npn 2176 3744 R0
SYMATTR InstName Q2
SYMATTR Value 2N3904
SYMBOL res 2224 4176 R0
SYMATTR InstName R8
SYMATTR Value 1m
SYMBOL res 1648 3808 R270
WINDOW 0 32 56 VTop 2
WINDOW 3 0 56 VBottom 2
SYMATTR InstName R9
SYMATTR Value 200
SYMBOL res 1248 3312 R90
WINDOW 0 0 56 VBottom 2
WINDOW 3 32 56 VTop 2
SYMATTR InstName R24
SYMATTR Value 1m
SYMBOL voltage 1504 4128 R0
WINDOW 123 0 0 Left 0
WINDOW 39 0 0 Left 0
SYMATTR InstName V_IN1
SYMATTR Value PULSE({VL} {VH} 0 1n 1n 24n 50n 1000)
SYMBOL schottky 1952 3696 R270
WINDOW 0 32 32 VTop 2
WINDOW 3 0 32 VBottom 2
SYMATTR InstName D2
SYMATTR Value BAT54
SYMATTR Description Diode
SYMATTR Type diode
SYMBOL res 1824 3552 R0
SYMATTR InstName R13
SYMATTR Value 1k
SYMBOL res 2224 3376 R0
SYMATTR InstName R21
SYMATTR Value 500
SYMBOL res 1776 3984 R0
SYMATTR InstName R7
SYMATTR Value 20
SYMBOL diode 1776 4288 R0
SYMATTR InstName D7
SYMATTR Value 1N914
SYMBOL npn 3104 3744 R0
SYMATTR InstName Q3
SYMATTR Value 2N3904
SYMBOL res 3152 4176 R0
SYMATTR InstName R6
SYMATTR Value 1m
SYMBOL res 2576 3808 R270
WINDOW 0 32 56 VTop 2
WINDOW 3 0 56 VBottom 2
SYMATTR InstName R10
SYMATTR Value 200
SYMBOL schottky 2880 3696 R270
WINDOW 0 32 32 VTop 2
WINDOW 3 0 32 VBottom 2
SYMATTR InstName D3
SYMATTR Value BAT54
SYMATTR Description Diode
SYMATTR Type diode
SYMBOL res 2752 3552 R0
SYMATTR InstName R14
SYMATTR Value 1k
SYMBOL res 3152 3376 R0
SYMATTR InstName R15
SYMATTR Value 500
SYMBOL res 2704 3984 R0
SYMATTR InstName R16
SYMATTR Value 20
SYMBOL diode 2704 4288 R0
SYMATTR InstName D4
SYMATTR Value 1N914
SYMBOL npn 4048 3744 R0
SYMATTR InstName Q4
SYMATTR Value 2N3904
SYMBOL res 4096 4176 R0
SYMATTR InstName R17
SYMATTR Value 1m
SYMBOL res 3520 3808 R270
WINDOW 0 32 56 VTop 2
WINDOW 3 0 56 VBottom 2
SYMATTR InstName R18
SYMATTR Value 200
SYMBOL schottky 3824 3696 R270
WINDOW 0 32 32 VTop 2
WINDOW 3 0 32 VBottom 2
SYMATTR InstName D5
SYMATTR Value BAT54
SYMATTR Description Diode
SYMATTR Type diode
SYMBOL res 3696 3552 R0
SYMATTR InstName R19
SYMATTR Value 1k
SYMBOL res 4096 3376 R0
SYMATTR InstName R20
SYMATTR Value 500
SYMBOL res 3648 3984 R0
SYMATTR InstName R22
SYMATTR Value 20
SYMBOL diode 3648 4288 R0
SYMATTR InstName D6
SYMATTR Value 1N914
SYMBOL npn 4976 3744 R0
SYMATTR InstName Q5
SYMATTR Value 2N3904
SYMBOL res 5024 4176 R0
SYMATTR InstName R23
SYMATTR Value 1m
SYMBOL res 4448 3808 R270
WINDOW 0 32 56 VTop 2
WINDOW 3 0 56 VBottom 2
SYMATTR InstName R25
SYMATTR Value 200
SYMBOL schottky 4752 3696 R270
WINDOW 0 32 32 VTop 2
WINDOW 3 0 32 VBottom 2
SYMATTR InstName D8
SYMATTR Value BAT54
SYMATTR Description Diode
SYMATTR Type diode
SYMBOL res 4624 3552 R0
SYMATTR InstName R27
SYMATTR Value 1k
SYMBOL res 5024 3376 R0
SYMATTR InstName R28
SYMATTR Value 500
SYMBOL res 4576 3984 R0
SYMATTR InstName R29
SYMATTR Value 20
SYMBOL diode 4576 4288 R0
SYMATTR InstName D9
SYMATTR Value 1N914
SYMBOL npn 2144 5488 R0
SYMATTR InstName Q6
SYMATTR Value 2N3904
SYMBOL res 2192 5920 R0
SYMATTR InstName R30
SYMATTR Value 1m
SYMBOL res 1616 5552 R270
WINDOW 0 32 56 VTop 2
WINDOW 3 0 56 VBottom 2
SYMATTR InstName R31
SYMATTR Value 100
SYMBOL voltage 960 5696 R0
WINDOW 123 0 0 Left 0
WINDOW 39 0 0 Left 0
SYMATTR InstName VCC_3
SYMATTR Value 3
SYMBOL res 1216 5056 R90
WINDOW 0 0 56 VBottom 2
WINDOW 3 32 56 VTop 2
SYMATTR InstName R32
SYMATTR Value 1m
SYMBOL schottky 1920 5440 R270
WINDOW 0 32 32 VTop 2
WINDOW 3 0 32 VBottom 2
SYMATTR InstName D10
SYMATTR Value BAT54
SYMATTR Description Diode
SYMATTR Type diode
SYMBOL res 1792 5296 R0
SYMATTR InstName R33
SYMATTR Value 1k
SYMBOL res 2192 5120 R0
SYMATTR InstName R34
SYMATTR Value 500
SYMBOL res 1744 5728 R0
SYMATTR InstName R35
SYMATTR Value 20
SYMBOL diode 1744 6032 R0
SYMATTR InstName D11
SYMATTR Value 1N914
SYMBOL res 3120 5120 R0
SYMATTR InstName R36
SYMATTR Value 1m
SYMBOL res 2544 5552 R270
WINDOW 0 32 56 VTop 2
WINDOW 3 0 56 VBottom 2
SYMATTR InstName R37
SYMATTR Value 100
SYMBOL schottky 3024 5664 R90
WINDOW 0 0 32 VBottom 2
WINDOW 3 32 32 VTop 2
SYMATTR InstName D12
SYMATTR Value BAT54
SYMATTR Description Diode
SYMATTR Type diode
SYMBOL res 2752 5616 R0
SYMATTR InstName R38
SYMATTR Value 1k
SYMBOL res 3120 5920 R0
SYMATTR InstName R39
SYMATTR Value 500
SYMBOL res 2672 5328 R0
SYMATTR InstName R40
SYMATTR Value 20
SYMBOL diode 2704 5216 R180
WINDOW 0 24 64 Left 2
WINDOW 3 24 0 Left 2
SYMATTR InstName D13
SYMATTR Value 1N914
SYMBOL npn 4016 5488 R0
SYMATTR InstName Q8
SYMATTR Value 2N3904
SYMBOL res 4064 5920 R0
SYMATTR InstName R41
SYMATTR Value 1m
SYMBOL res 3488 5552 R270
WINDOW 0 32 56 VTop 2
WINDOW 3 0 56 VBottom 2
SYMATTR InstName R42
SYMATTR Value 100
SYMBOL schottky 3792 5440 R270
WINDOW 0 32 32 VTop 2
WINDOW 3 0 32 VBottom 2
SYMATTR InstName D14
SYMATTR Value BAT54
SYMATTR Description Diode
SYMATTR Type diode
SYMBOL res 3664 5296 R0
SYMATTR InstName R43
SYMATTR Value 1k
SYMBOL res 4064 5120 R0
SYMATTR InstName R44
SYMATTR Value 500
SYMBOL res 3616 5728 R0
SYMATTR InstName R45
SYMATTR Value 20
SYMBOL diode 3616 6032 R0
SYMATTR InstName D15
SYMATTR Value 1N914
SYMBOL npn 4944 5488 R0
SYMATTR InstName Q10
SYMATTR Value 2N3904
SYMBOL res 4992 5920 R0
SYMATTR InstName R46
SYMATTR Value 1m
SYMBOL res 4416 5552 R270
WINDOW 0 32 56 VTop 2
WINDOW 3 0 56 VBottom 2
SYMATTR InstName R47
SYMATTR Value 100
SYMBOL schottky 4720 5440 R270
WINDOW 0 32 32 VTop 2
WINDOW 3 0 32 VBottom 2
SYMATTR InstName D16
SYMATTR Value BAT54
SYMATTR Description Diode
SYMATTR Type diode
SYMBOL res 4592 5296 R0
SYMATTR InstName R48
SYMATTR Value 1k
SYMBOL res 4992 5120 R0
SYMATTR InstName R49
SYMATTR Value 500
SYMBOL res 4544 5728 R0
SYMATTR InstName R50
SYMATTR Value 20
SYMBOL diode 4544 6032 R0
SYMATTR InstName D17
SYMATTR Value 1N914
SYMBOL pnp 3072 5584 M180
SYMATTR InstName Q7
SYMATTR Value 2N3906
SYMBOL npn 9792 3744 R0
SYMATTR InstName Q11
SYMATTR Value 2N3904
SYMBOL res 9840 4176 R0
SYMATTR InstName R51
SYMATTR Value 1m
SYMBOL res 9264 3808 R270
WINDOW 0 32 56 VTop 2
WINDOW 3 0 56 VBottom 2
SYMATTR InstName R52
SYMATTR Value 100
SYMBOL schottky 9568 3696 R270
WINDOW 0 32 32 VTop 2
WINDOW 3 0 32 VBottom 2
SYMATTR InstName D18
SYMATTR Value BAT54
SYMATTR Description Diode
SYMATTR Type diode
SYMBOL res 9440 3552 R0
SYMATTR InstName R53
SYMATTR Value 1k
SYMBOL res 9840 3216 R0
SYMATTR InstName R54
SYMATTR Value 500
SYMBOL res 9392 3984 R0
SYMATTR InstName R55
SYMATTR Value 20
SYMBOL diode 9392 4288 R0
SYMATTR InstName D19
SYMATTR Value 1N914
SYMBOL npn 8272 3744 M0
SYMATTR InstName Q12
SYMATTR Value 2N3904
SYMBOL res 8224 4176 M0
SYMATTR InstName R56
SYMATTR Value 1m
SYMBOL res 8800 3808 M270
WINDOW 0 32 56 VTop 2
WINDOW 3 0 56 VBottom 2
SYMATTR InstName R57
SYMATTR Value 100
SYMBOL schottky 8496 3696 M270
WINDOW 0 32 32 VTop 2
WINDOW 3 0 32 VBottom 2
SYMATTR InstName D20
SYMATTR Value BAT54
SYMATTR Description Diode
SYMATTR Type diode
SYMBOL res 8624 3552 M0
SYMATTR InstName R58
SYMATTR Value 1k
SYMBOL res 8224 3216 M0
SYMATTR InstName R59
SYMATTR Value 500
SYMBOL res 8672 3984 M0
SYMATTR InstName R60
SYMATTR Value 20
SYMBOL diode 8672 4288 M0
SYMATTR InstName D21
SYMATTR Value 1N914
SYMBOL pnp 6496 3568 M180
SYMATTR InstName Q13
SYMATTR Value 2N3906
SYMBOL pnp 10704 3568 R180
SYMATTR InstName Q14
SYMATTR Value 2N3906
SYMBOL res 6336 3536 M270
WINDOW 0 32 56 VTop 2
WINDOW 3 0 56 VBottom 2
SYMATTR InstName R61
SYMATTR Value 100
SYMBOL res 6336 3360 M270
WINDOW 0 32 56 VTop 2
WINDOW 3 0 56 VBottom 2
SYMATTR InstName R62
SYMATTR Value 100
SYMBOL res 11008 3536 M270
WINDOW 0 32 56 VTop 2
WINDOW 3 0 56 VBottom 2
SYMATTR InstName R64
SYMATTR Value 100
SYMBOL npn 6352 3296 R0
SYMATTR InstName Q17
SYMATTR Value 2N3904
SYMBOL res 10880 3360 R270
WINDOW 0 32 56 VTop 2
WINDOW 3 0 56 VBottom 2
SYMATTR InstName R63
SYMATTR Value 100
SYMBOL npn 10864 3296 M0
SYMATTR InstName Q15
SYMATTR Value 2N3904
SYMBOL npn 6832 3488 M0
SYMATTR InstName Q16
SYMATTR Value 2N3904
SYMBOL res 6784 3216 M0
SYMATTR InstName R65
SYMATTR Value 2k
SYMBOL npn 10416 3488 R0
SYMATTR InstName Q18
SYMATTR Value 2N3904
SYMBOL res 10464 3216 R0
SYMATTR InstName R66
SYMATTR Value 1k
SYMBOL res 7088 3552 M270
WINDOW 0 32 56 VTop 2
WINDOW 3 0 56 VBottom 2
SYMATTR InstName R67
SYMATTR Value 2k
SYMBOL res 10144 3552 M270
WINDOW 0 32 56 VTop 2
WINDOW 3 0 56 VBottom 2
SYMATTR InstName R68
SYMATTR Value 1k
SYMBOL res 10272 3808 M0
SYMATTR InstName R70
SYMATTR Value 1k
SYMBOL schottky 6896 3456 M270
WINDOW 0 32 32 VTop 2
WINDOW 3 0 32 VBottom 2
SYMATTR InstName D22
SYMATTR Value BAT54
SYMATTR Description Diode
SYMATTR Type diode
SYMBOL res 6336 3184 M270
WINDOW 0 32 56 VTop 2
WINDOW 3 0 56 VBottom 2
SYMATTR InstName R71
SYMATTR Value 1m
SYMBOL voltage -48 1808 R0
WINDOW 123 0 0 Left 0
WINDOW 39 0 0 Left 0
SYMATTR InstName VCC1
SYMATTR Value {VL}
SYMBOL res 6912 3808 M0
SYMATTR InstName R72
SYMATTR Value 2k
SYMBOL npn 6320 4256 M0
SYMATTR InstName Q19
SYMATTR Value 2N3904
SYMBOL res 6240 4096 R0
SYMATTR InstName R69
SYMATTR Value 10k
SYMBOL npn 8048 3488 M0
SYMATTR InstName Q21
SYMATTR Value 2N3904
SYMBOL res 8000 3792 M0
SYMATTR InstName R73
SYMATTR Value 1k
TEXT -832 1968 Left 2 ;.tran {2*reps/freq}
TEXT -832 2024 Left 2 ;.ac oct 100 1k 100mega
TEXT -1112 1624 Left 2 !.param VCC=5
TEXT -1112 1656 Left 2 !.param freq=20mega
TEXT -1112 1688 Left 2 !.param rise=1n
TEXT -1112 1720 Left 2 !.param reps=1
TEXT -1112 1752 Left 2 !.param Rb=200
TEXT -1112 1456 Left 2 ;Rb controls gate delay (rise and fall edge) as well as gate power consumption.\n \nRb=100 --> 4/5ns gate delay; 35mA gate power\nRb=200 --> 6/8ns gate delay; 20mA gate power
TEXT -776 2168 Left 2 ;This is the original cascode video amplifier I had for the MAC project
TEXT 1464 4736 Left 2 ;.dc V_IN1 0 5 0.01
TEXT 1464 4672 Left 2 !.tran 500n
TEXT 1016 4688 Left 2 !.step temp -25 125 25
TEXT 1056 4768 Left 2 !;.step param VH 1 2.5 0.1
TEXT -1120 1792 Left 2 !.param VH=1.5
TEXT -1120 1824 Left 2 !.param VL=0.0

The netlist it stands for:
* register_bjt.asc
VCC VCC 0 {VCC}
Q9 N009 N010 N011 0 2N3904
R168 N006 N008 810
R169 N005 N007 1k
R171 N011 N016 15
R174 I1 N010 22
V_BIT5 A_IN N004 PULSE(0 {VH-VL} 0 {rise} {rise} {1/freq/2-rise} {1/freq} {256*reps}) AC {VH}
A11 _B_IN N004 A_IN N004 N004 _B_IN B_IN N004 DFLOP Vhigh={VH-VL}
A13 _C_IN N004 B_IN N004 N004 _C_IN C_IN N004 DFLOP Vhigh={VH-VL}
A15 N002 N004 N001 N004 N004 N002 _AND_EN N004 DFLOP Vhigh={VH-VL}
A16 N003 N004 _AND_EN N004 N004 N003 _OR_EN N004 DFLOP Vhigh={VH-VL}
A14 _ADD_EN N004 C_IN N004 N004 _ADD_EN N001 N004 DFLOP Vhigh={VH-VL}
R107 COUT_1 _AND_EN 1m
R109 COUT_0 N001 1m
R11 B_IN D 1m
R12 _B_IN _D 1m
R26 A_IN EN 1m
Q1 N007 N008 N009 0 2N3904
R1 N008 N011 100
D1 0 N016 1N4148
VCC_NEG 0 N017 12
R3 N017 N016 180
VCC_12 N005 0 30
V_IN I1 0 PULSE(0 3 0 1n 1n 24n 50n 1000)
VCC_1 N006 0 12
R2 I1 0 75
R4 _O1 N007 220
R5 0 _O1 10k
Q2 O1 N023 N029 0 2N3904
R8 N029 0 1m
R9 IN N023 200
R24 N013 VCC 1m
V_IN1 IN 0 PULSE({VL} {VH} 0 1n 1n 24n 50n 1000)
D2 N023 O1 BAT54
R13 O1 N023 1k
R21 N013 O1 500
R7 N023 N036 20
D7 N036 0 1N914
Q3 O2 N024 N030 0 2N3904
R6 N030 0 1m
R10 O1 N024 200
D3 N024 O2 BAT54
R14 O2 N024 1k
R15 N013 O2 500
R16 N024 N037 20
D4 N037 0 1N914
Q4 O3 N025 N031 0 2N3904
R17 N031 0 1m
R18 O2 N025 200
D5 N025 O3 BAT54
R19 O3 N025 1k
R20 N013 O3 500
R22 N025 N038 20
D6 N038 0 1N914
Q5 O4 N026 N032 0 2N3904
R23 N032 0 1m
R25 O3 N026 200
D8 N026 O4 BAT54
R27 O4 N026 1k
R28 N013 O4 500
R29 N026 N039 20
D9 N039 0 1N914
Q6 S1 N045 N051 0 2N3904
R30 N051 0 1m
R31 IN N045 100
VCC_3 N042 0 3
R32 N043 N042 1m
D10 N045 S1 BAT54
R33 S1 N045 1k
R34 N043 S1 500
R35 N045 N054 20
D11 N054 0 1N914
R36 N043 N048 1m
R37 IN N049 100
D12 S2 N049 BAT54
R38 N049 S2 1k
R39 S2 0 500
R40 N044 N049 20
D13 N044 N043 1N914
Q8 S3 N046 N052 0 2N3904
R41 N052 0 1m
R42 N050 N046 100
D14 N046 S3 BAT54
R43 S3 N046 1k
R44 N043 S3 500
R45 N046 N055 20
D15 N055 0 1N914
Q10 S4 N047 N053 0 2N3904
R46 N053 0 1m
R47 S3 N047 100
D16 N047 S4 BAT54
R48 S4 N047 1k
R49 N043 S4 500
R50 N047 N056 20
D17 N056 0 1N914
Q7 S2 N049 N048 0 2N3906
Q11 _O N028 N034 0 2N3904
R51 N034 0 1m
R52 O N028 100
D18 N028 _O BAT54
R53 _O N028 1k
R54 N012 _O 500
R55 N028 N041 20
D19 N041 0 1N914
Q12 O N027 N033 0 2N3904
R56 N033 0 1m
R57 _O N027 100
D20 N027 O BAT54
R58 O N027 1k
R59 N012 O 500
R60 N027 N040 20
D21 N040 0 1N914
Q13 0 N019 O 0 2N3906
Q14 0 N020 _O 0 2N3906
R61 N019 _B_IN 100
R62 N014 C_IN 100
R64 B_IN N020 100
Q17 N012 N014 N019 0 2N3904
R63 N015 C_IN 100
Q15 N012 N015 N020 0 2N3904
Q16 _OO N018 0 0 2N3904
R65 N012 _OO 2k
Q18 NC_01 N022 0 0 2N3904
R66 N012 NC_02 1k
R67 N021 N018 2k
R68 N022 NC_03 1k
R70 N022 0 1k
D22 N018 _OO BAT54
R71 N012 VCC 1m
VCC1 N004 0 {VL}
R72 NC_04 0 2k
Q19 N035 N035 0 0 2N3904
R69 VCC N035 10k
Q21 N012 O N021 0 2N3904
R73 N021 0 1k
.model D D
.lib standard.dio
.model NPN NPN
.model PNP PNP
.lib standard.bjt
* .tran {2*reps/freq}
* .ac oct 100 1k 100mega
.param VCC=5
.param freq=20mega
.param rise=1n
.param reps=1
.param Rb=200
* Rb controls gate delay (rise and fall edge) as well as gate power consumption.
* Rb=100 --> 4/5ns gate delay; 35mA gate power
* Rb=200 --> 6/8ns gate delay; 20mA gate power
* This is the original cascode video amplifier I had for the MAC project
* .dc V_IN1 0 5 0.01
.tran 500n
.step temp -25 125 25
;.step param VH 1 2.5 0.1
.param VH=1.5
.param VL=0.0
.backanno
.end